# Altium schematic sheet esp32.SchDoc: ESP32 Module
size A3; Author: Pietro Lorefice; Address3: Firenze; Address4: ITALY; Revision: 0; SheetNumber: 2; SheetTotal: 2; License: GPLv3
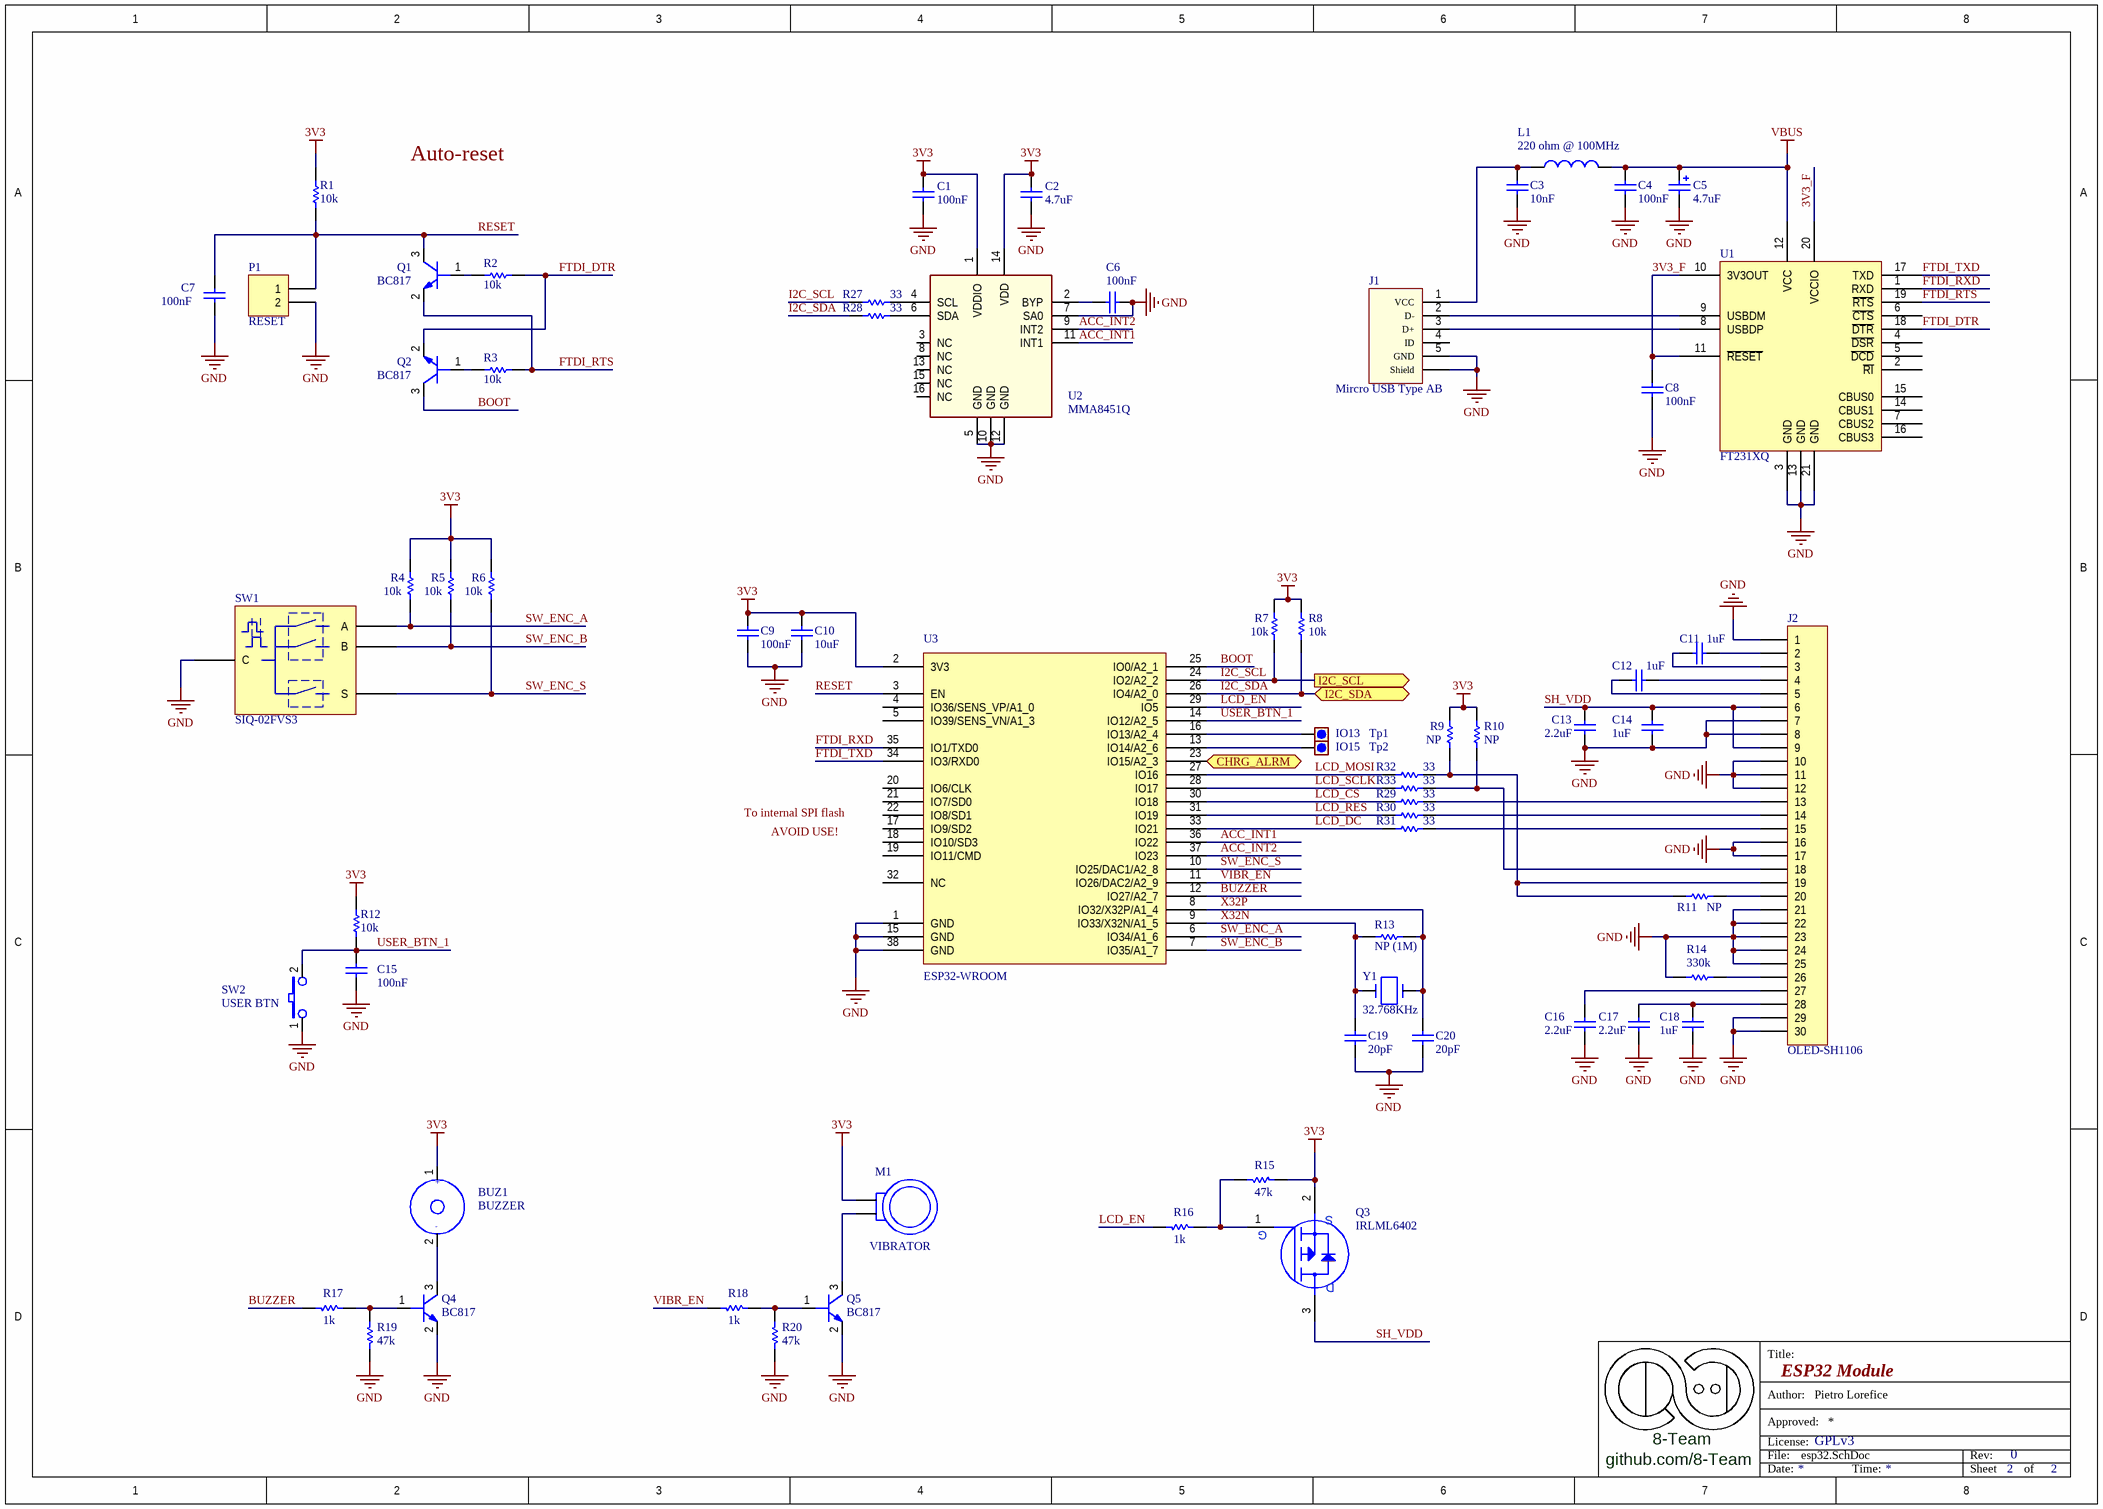
[diagram p0: esp32.SchDoc]

## Parts
BUZ1  BUZZER  [BUZZER_9x9MM_SMD]
C1  100nF  [0402_[1005]]
C2  4.7uF  [0603_[1608]]
C3  10nF  [0402_[1005]]
C4  100nF  [0402_[1005]]
C5  4.7uF  [0603_[1608]]
C6  100nF  [0402_[1005]]
C7  100nF  [0402_[1005]]
C8  100nF  [0402_[1005]]
C9  100nF  [0402_[1005]]
C10  10uF  [0603_[1608]]
C11  1uF  [0603_[1608]]
C12  1uF  [0603_[1608]]
C13  2.2uF  [0603_[1608]]
C14  1uF  [0603_[1608]]
C15  100nF  [0402_[1005]]
C16  2.2uF  [0603_[1608]]
C17  2.2uF  [0603_[1608]]
C18  1uF  [0603_[1608]]
C19  20pF  [0402_[1005]]
C20  20pF  [0402_[1005]]
J1  Mircro USB Type AB  [USB_MIRCO_AB_SMD]
J2  OLED-SH1106  [flat_30pin_0,7mm]
L1  220 ohm @ 100MHz  [0805_[2012]]
M1  VIBRATOR  [HEADER_1X2_2.54MM_THD]
P1  RESET  [HEADER_1X2_2.54MM_THD]
Q1  BC817  [SOT-23]
Q2  BC817  [SOT-23]
Q3  IRLML6402  [SOT-23]
Q4  BC817  [SOT-23]
Q5  BC817  [SOT-23]
R1  10k  [0402_[1005]]
R2  10k  [0402_[1005]]
R3  10k  [0402_[1005]]
R4  10k  [0402_[1005]]
R5  10k  [0402_[1005]]
R6  10k  [0402_[1005]]
R7  10k  [0402_[1005]]
R8  10k  [0402_[1005]]
R9  NP  [0402_[1005]]
R10  NP  [0402_[1005]]
R11  NP  [0402_[1005]]
R12  10k  [0402_[1005]]
R13  NP (1M)  [0402_[1005]]
R14  330k  [0402_[1005]]
R15  47k  [0402_[1005]]
R16  1k  [0402_[1005]]
R17  1k  [0402_[1005]]
R18  1k  [0402_[1005]]
R19  47k  [0402_[1005]]
R20  47k  [0402_[1005]]
R27  33  [0402_[1005]]
R28  33  [0402_[1005]]
R29  33  [0402_[1005]]
R30  33  [0402_[1005]]
R31  33  [0402_[1005]]
R32  33  [0402_[1005]]
R33  33  [0402_[1005]]
SW1  SIQ-02FVS3  [SIQ-02FVS3]
SW2  USER BTN  [TACTILE_SWITCH_6x3.8MM_SMD]
Tp1  IO13  [TEST_POINT_SMD_D1.6MM]  (no BOM)
Tp2  IO15  [TEST_POINT_SMD_D1.6MM]  (no BOM)
U1  FT231XQ  [QFN50P400X400X80_HS-21L]
U2  MMA8451Q  [QFN50P300X300X100-16L]
U3  ESP32-WROOM  [ESP-WROOM-32]
Y1  32.768KHz  [CRYSTAL_3.2X1.5MM_2P_SMD]

## Ports
CHRG_ALRM (in), I2C_SCL (out), I2C_SDA (bidir)

## Nets
3V3: BUZ1.1 C1.2 C2.2 C9.2 C10.2 M1.1(VP) Q3.2(S) R1.2 R4.2 R5.2 R6.2 R7.2 R8.2 R9.2 R10.2 R12.2 R15.1 U2.1(VDDIO) U2.14(VDD) U3.2(3V3)
GND: C1.1 C2.1 C3.1 C4.1 C5.2 C6.1 C7.1 C8.1 C9.1 C10.1 C13.1 C14.1 C15.1 C16.1 C17.1 C18.1 C19.1 C20.1 J1.5(GND) J1.Shell(Shield) J2.1 J2.7 J2.8 J2.10 J2.11 J2.12 J2.16 J2.17 J2.21 J2.22 J2.23 J2.24 J2.25 J2.29 J2.30 P1.2 Q4.2(E) Q5.2(E) R14.2 R19.2 R20.2 SW1.4(C) SW2.1 U1.3(GND) U1.13(GND) U1.21(GND) U2.5(GND) U2.7(SA0) U2.10(GND) U2.12(GND) U3.1(GND) U3.15(GND) U3.38(GND)
VBUS: C4.2 C5.1 L1.2 U1.12(VCC)
3V3_F: C8.2 U1.10(3V3OUT) U1.11(~{RESET}) U1.20(VCCIO)
ACC_INT1: U2.11(INT1) U3.36(IO22)
ACC_INT2: U2.9(INT2) U3.37(IO23)
BOOT: Q2.3(C) U3.25(IO0/A2_1)
BUZZER: R17.2 U3.12(IO27/A2_7)
CHRG_ALRM: U3.23(IO15/A2_3) ; port CHRG_ALRM
FTDI_DTR: Q2.2(E) R2.1 U1.18(~{DTR})
FTDI_RTS: Q1.2(E) R3.1 U1.19(~{RTS})
FTDI_RXD: U1.1(RXD) U3.35(IO1/TXD0)
FTDI_TXD: U1.17(TXD) U3.34(IO3/RXD0)
I2C_SCL: R7.1 R27.1 U3.24(IO2/A2_2) ; port I2C_SCL
I2C_SDA: R8.1 R28.1 U3.26(IO4/A2_0) ; port I2C_SDA
LCD_CS: R29.1 U3.30(IO18)
LCD_DC: R31.1 U3.33(IO21)
LCD_EN: R16.2 U3.29(IO5)
LCD_MOSI: R32.1 U3.27(IO16)
LCD_RES: R30.1 U3.31(IO19)
LCD_SCLK: R33.1 U3.28(IO17)
RESET: C7.2 P1.1 Q1.3(C) R1.1 U3.3(EN)
SH_VDD: C13.2 C14.2 J2.6 J2.9 Q3.3(D)
SW_ENC_A: R4.1 SW1.1(A) U3.6(IO34/A1_6)
SW_ENC_B: R5.1 SW1.2(B) U3.7(IO35/A1_7)
SW_ENC_S: R6.1 SW1.3(S) U3.10(IO25/DAC1/A2_8)
USER_BTN_1: C15.2 R12.1 SW2.2 U3.14(IO12/A2_5)
VIBR_EN: R18.2 U3.11(IO26/DAC2/A2_9)
X32N: C19.2 R13.1 U3.9(IO33/X32N/A1_5) Y1.1
X32P: C20.2 R13.2 U3.8(IO32/X32P/A1_4) Y1.2
NetBUZ1_2: BUZ1.2 Q4.3(C)
NetC3_2: C3.2 J1.1(VCC) L1.1
NetC6_2: C6.2 U2.2(BYP)
NetC11_1: C11.1 J2.2
NetC11_2: C11.2 J2.3
NetC12_1: C12.1 J2.4
NetC12_2: C12.2 J2.5
NetC16_2: C16.2 J2.27
NetC17_2: C17.2 C18.2 J2.28
NetJ1_2: J1.2(D-) U1.9(USBDM)
NetJ1_3: J1.3(D+) U1.8(USBDP)
NetJ2_13: J2.13 R29.2
NetJ2_14: J2.14 R30.2
NetJ2_15: J2.15 R31.2
NetJ2_18: J2.18 R10.1 R33.2
NetJ2_19: J2.19 R9.1 R11.1 R32.2
NetJ2_20: J2.20 R11.2
NetJ2_26: J2.26 R14.1
NetM1_2: M1.2(VN) Q5.3(C)
NetQ1_1: Q1.1(B) R2.2
NetQ2_1: Q2.1(B) R3.2
NetQ3_1: Q3.1(G) R15.2 R16.1
NetQ4_1: Q4.1(B) R17.1 R19.1
NetQ5_1: Q5.1(B) R18.1 R20.1
NetR27_2: R27.2 U2.4(SCL)
NetR28_2: R28.2 U2.6(SDA)
NetTp1_1: Tp1.1 U3.16(IO13/A2_4)
NetTp2_1: Tp2.1 U3.13(IO14/A2_6)

Not connected (* = marked no-connect by the designer): J1 4(ID); SW2 3(GND) 4(GND); U1 2(~{RI}) 4(~{DSR}) 5(~{DCD}) 6(~{CTS}) 7(CBUS2) 14(CBUS1) 15(CBUS0) 16(CBUS3); U2 3(NC) 8(NC) 13(NC) 15(NC) 16(NC); U3 4(IO36/SENS_VP/A1_0) 5(IO39/SENS_VN/A1_3) 17(IO9/SD2) 18(IO10/SD3) 19(IO11/CMD) 20(IO6/CLK) 21(IO7/SD0) 22(IO8/SD1) 32(NC)

## Notes on the sheet
- Auto-reset
- Title:
- Author:
- 8-Team
- File:
- License:
- Approved:
- Rev:
- github.com/8-Team
- Date:
- Time:
- Sheet
- of
- (in symbol BUZZER) +; -
- (in symbol ESP32-WROOM) To internal SPI flash; AVOID USE!

## Library data of the parts
C1 C2 C6 = Cap: X7R 10%; Value: 10nF; Published: 8-Jun-2000; Revision: July-2002: Re-released for DXP Platform.; Publisher: Altium Limited
C3 C4 C7-C9 C15 = Cap: Capacitor; Value: 0.1uF; Published: 8-Jun-2000; LatestRevisionDate: 17-Jul-2002; LatestRevisionNote: Re-released for DXP Platform.; PackageReference: RAD-0.3; Publisher: Altium Limited; PackageDescription: Radial Cap, Thru-Hole; 2 Leads; 0.3 in Pin Spacing
C5 = Cap Pol1: Polarized Capacitor (Radial); Value: 10uF; Published: 8-Jun-2000; Revision: July-2002: Re-released for DXP Platform.; Publisher: Altium Limited
C10 = Cap: Capacitor; Published: 8-Jun-2000; LatestRevisionDate: 17-Jul-2002; LatestRevisionNote: Re-released for DXP Platform.; PackageReference: RAD-0.3; Publisher: Altium Limited; PackageDescription: Radial Cap, Thru-Hole; 2 Leads; 0.3 in Pin Spacing; Value: 10uF
C11-C14 C16-C20 = Cap: Capacitor; Value: 10nF; Published: 8-Jun-2000; Revision: July-2002: Re-released for DXP Platform.; Publisher: Altium Limited
J1 = USB_MICRO_TypeAB: Micro USB 2.0 Type AB Horizontal WR-COM; Part Number: 629105150921; Interface Type: Type AB; Gender: Receptacle; ComponentLink1Description: Manufacturer; ComponentLink1URL: http://www.we-online.de; ComponentLink2Description: Datasheet; ComponentLink2URL: http://katalog.we-online.de/em/datasheet/629105150921.pdf; Published Date: April 2017; Publisher: Wurth Elektronik; Sub-Family: Micro USB 2.0; Type: Horizontal; Construction: SMT
J2 = Header 30: Header, 30-Pin; LatestRevisionDate: 17-Jul-2002; LatestRevisionNote: Re-released for DXP Platform.; Publisher: Altium Limited
L1 = Inductor
M1 = Coin vibration motor
P1 = Header 2: Header, 2-Pin; LatestRevisionDate: 17-Jul-2002; LatestRevisionNote: Re-released for DXP Platform.; Publisher: Altium Limited
Q1 Q2 Q4 Q5 = BC817: BJT NPN
Q3 = MOSFET-P 3pin
R1-R6 R12 R14 R16-R18 = Res1: Resistor; Published: 8-Jun-2000; Publisher: Altium Limited
  R1-R6 R12: LatestRevisionDate: 17-Jul-2002; LatestRevisionNote: Re-released for DXP Platform.; PackageReference: AXIAL-0.3; PackageDescription: Axial Device, Thru-Hole; 2 Leads; 0.3 in Pin Spacing; Value: 10K
  R14: LatestRevisionDate: 17-Jul-2002; LatestRevisionNote: Re-released for DXP Platform.; PackageReference: AXIAL-0.3; PackageDescription: Axial Device, Thru-Hole; 2 Leads; 0.3 in Pin Spacing; Value: 330K
  R16-R18: Revision: July-2002: Re-released for DXP Platform.; Value: 1K
R7-R10 = Res1: Resistor; Value: 4.7K; Published: 8-Jun-2000; LatestRevisionDate: 17-Jul-2002; LatestRevisionNote: Re-released for DXP Platform.; PackageReference: AXIAL-0.3; Publisher: Altium Limited; PackageDescription: Axial Device, Thru-Hole; 2 Leads; 0.3 in Pin Spacing
R11 R13 R27-R33 = Res1: Resistor; Value: NC; Published: 8-Jun-2000; LatestRevisionDate: 17-Jul-2002; LatestRevisionNote: Re-released for DXP Platform.; PackageReference: AXIAL-0.3; Publisher: Altium Limited; PackageDescription: Axial Device, Thru-Hole; 2 Leads; 0.3 in Pin Spacing
R15 R19 R20 = Res1: Resistor; Value: 1K; Published: 8-Jun-2000; Revision: July-2002: Re-released for DXP Platform.; Publisher: Altium Limited
SW1 = Rotary Encoder Switch: Slide and Rotary Encoder Switches
SW2 = SWITCH-RA: TACTILE Switch, 6x3.8mm, 2p (WE 434111025826); Part Number: Tyco FSMRA2JH; Purchase Code: RS 479-1520
Tp1 Tp2 = Test_point
U1 = FT231X: USB to FULL HANDSHAKE UART IC
U2 = MMA8451: 3-Axis,  14-bit/8-bit Digital Accelerometer
U3 = ESP32-WROOM: Wi-Fi+BT+BLE MCU module based on ESP32-D0WDQ6
Y1 = 24MHZ-SMD: Crystal 24 MHz SMT 25X2 Low Profile; Part Number: Aker C2E-24.000-12-3030-X; Purchase Code: RS 671-9564